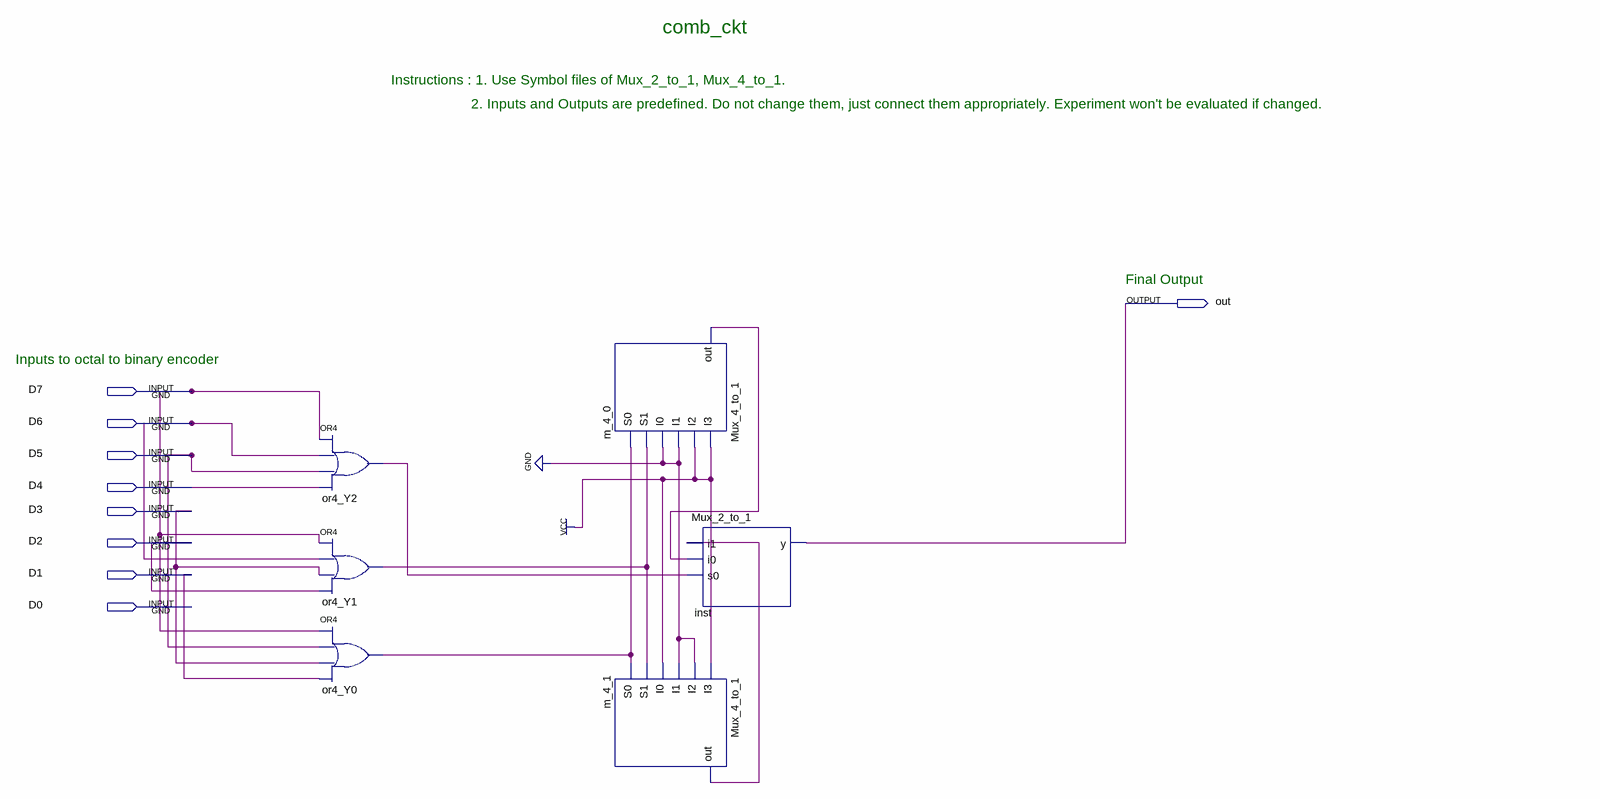
[diagram p0: schematic sheet]
// Quartus schematic comb_ckt.bdf as structural Verilog: 6 symbols, 9 pins
module comb_ckt (
  input  D7,
  input  D6,
  input  D5,
  input  D4,
  input  D3,
  input  D2,
  input  D1,
  input  D0,
  output out
);

  wire m_4_0_out, m_4_1_out, or4_Y0_out, or4_Y1_out, or4_Y2_out;

  or or4_Y2 (or4_Y2_out, D7, D6, D5, D4);
  or or4_Y1 (or4_Y1_out, D7, D6, D3, D2);
  or or4_Y0 (or4_Y0_out, D7, D5, D3, D1);
  Mux_4_to_1 m_4_0 (.I3(1'b1), .I2(1'b1), .I1(1'b0), .I0(1'b0), .S1(or4_Y1_out), .S0(or4_Y0_out), .out(m_4_0_out));
  Mux_4_to_1 m_4_1 (.I3(1'b1), .I2(1'b0), .I1(1'b0), .I0(1'b1), .S1(or4_Y1_out), .S0(or4_Y0_out), .out(m_4_1_out));
  Mux_2_to_1 inst (.i1(m_4_1_out), .i0(m_4_0_out), .s0(or4_Y2_out), .y(out));

  // Notes on the sheet:
  //   comb_ckt
  //   Instructions : 1. Use Symbol files of Mux_2_to_1, Mux_4_to_1. 
  //   2. Inputs and Outputs are predefined. Do not change them, just connect them appropriately. Experiment won't be evaluated if changed.
  //   Final Output
  //   Inputs to octal to binary encoder
endmodule
